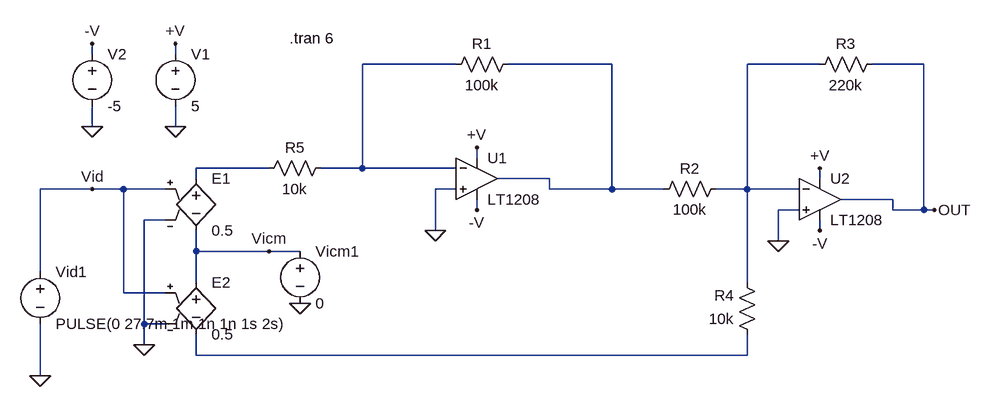
[diagram p0: schematic ETAJ1 ANALIZA TRANS SR.asc]
ETAJ1 ANALIZA TRANS SR.asc, the LTspice schematic file:
Version 4
SHEET 1 1024 752
WIRE -784 -96 -784 -112
WIRE -656 -96 -656 -112
WIRE -224 -80 -368 -80
WIRE 16 -80 -144 -80
WIRE 336 -80 224 -80
WIRE 496 -80 416 -80
WIRE -784 16 -784 -16
WIRE -656 16 -656 -16
WIRE -192 64 -192 48
WIRE -512 80 -624 80
WIRE -368 80 -368 -80
WIRE -368 80 -432 80
WIRE -224 80 -368 80
WIRE -624 96 -624 80
WIRE -80 96 -160 96
WIRE 336 96 336 80
WIRE -784 112 -864 112
WIRE -736 112 -784 112
WIRE -672 112 -736 112
WIRE -224 112 -256 112
WIRE -80 112 -80 96
WIRE 16 112 16 -80
WIRE 16 112 -80 112
WIRE 96 112 16 112
WIRE 224 112 224 -80
WIRE 224 112 176 112
WIRE 304 112 224 112
WIRE 448 128 368 128
WIRE -192 144 -192 128
WIRE 304 144 272 144
WIRE 448 144 448 128
WIRE 496 144 496 -80
WIRE 496 144 448 144
WIRE 512 144 496 144
WIRE -672 160 -704 160
WIRE -256 176 -256 112
WIRE 336 176 336 160
WIRE 272 192 272 144
WIRE -624 208 -624 176
WIRE -512 208 -624 208
WIRE -464 208 -512 208
WIRE -864 240 -864 112
WIRE -624 256 -624 208
WIRE 224 256 224 112
WIRE -736 272 -736 112
WIRE -672 272 -736 272
WIRE -704 320 -704 160
WIRE -672 320 -704 320
WIRE -704 352 -704 320
WIRE -624 368 -624 336
WIRE 224 368 224 336
WIRE 224 368 -624 368
WIRE -864 400 -864 320
FLAG -192 48 +V
FLAG -192 144 -V
FLAG 336 80 +V
FLAG 336 176 -V
FLAG 512 144 OUT
FLAG -256 176 0
FLAG 272 192 0
FLAG -864 400 0
FLAG -704 352 0
FLAG -464 288 0
FLAG -784 112 Vid
FLAG -512 208 Vicm
FLAG -656 16 0
FLAG -656 -112 +V
FLAG -784 16 0
FLAG -784 -112 -V
SYMBOL res -128 -96 R90
WINDOW 0 0 56 VBottom 2
WINDOW 3 32 56 VTop 2
SYMATTR InstName R1
SYMATTR Value 100k
SYMBOL res 192 96 R90
WINDOW 0 0 56 VBottom 2
WINDOW 3 32 56 VTop 2
SYMATTR InstName R2
SYMATTR Value 100k
SYMBOL res 432 -96 R90
WINDOW 0 0 56 VBottom 2
WINDOW 3 32 56 VTop 2
SYMATTR InstName R3
SYMATTR Value 220k
SYMBOL res 240 352 R180
WINDOW 0 36 76 Left 2
WINDOW 3 36 40 Left 2
SYMATTR InstName R4
SYMATTR Value 10k
SYMBOL e -624 80 R0
SYMATTR InstName E1
SYMATTR Value 0.5
SYMBOL e -624 240 R0
SYMATTR InstName E2
SYMATTR Value 0.5
SYMBOL voltage -464 192 R0
WINDOW 123 0 0 Left 0
WINDOW 39 0 0 Left 0
SYMATTR InstName Vicm1
SYMATTR Value 0
SYMBOL voltage -656 -112 R0
WINDOW 123 0 0 Left 2
WINDOW 39 0 0 Left 2
SYMATTR InstName V1
SYMATTR Value 5
SYMBOL voltage -784 -112 R0
WINDOW 123 0 0 Left 2
WINDOW 39 0 0 Left 2
SYMATTR InstName V2
SYMATTR Value -5
SYMBOL res -416 64 R90
WINDOW 0 0 56 VBottom 2
WINDOW 3 32 56 VTop 2
SYMATTR InstName R5
SYMATTR Value 10k
SYMBOL OpAmps\\LT1208 -192 32 R0
SYMATTR InstName U1
SYMBOL OpAmps\\LT1208 336 64 R0
SYMATTR InstName U2
SYMBOL voltage -864 224 R0
WINDOW 123 0 0 Left 0
WINDOW 39 0 0 Left 0
SYMATTR InstName Vid1
SYMATTR Value PULSE(0 27.7m 1m 1n 1n 1s 2s)
TEXT -480 -120 Left 2 !.tran 6

The netlist it stands for:
* ETAJ1 ANALIZA TRANS SR.asc
R1 N002 N001 100k
R2 N003 N002 100k
R3 OUT N003 220k
R4 N005 N003 10k
E1 N004 Vicm Vid 0 0.5
E2 Vicm N005 Vid 0 0.5
Vicm1 Vicm 0 0
V1 +V 0 5
V2 -V 0 -5
R5 N001 N004 10k
XU1 0 N001 +V -V N002 LT1208  ; pins In+ In- V+ V- OUT
XU2 0 N003 +V -V OUT LT1208  ; pins In+ In- V+ V- OUT
Vid1 Vid 0 PULSE(0 27.7m 1m 1n 1n 1s 2s)
.tran 6
.backanno
.end